# EAGLE design SAS_rev03 (EAGLE 6.6.0)
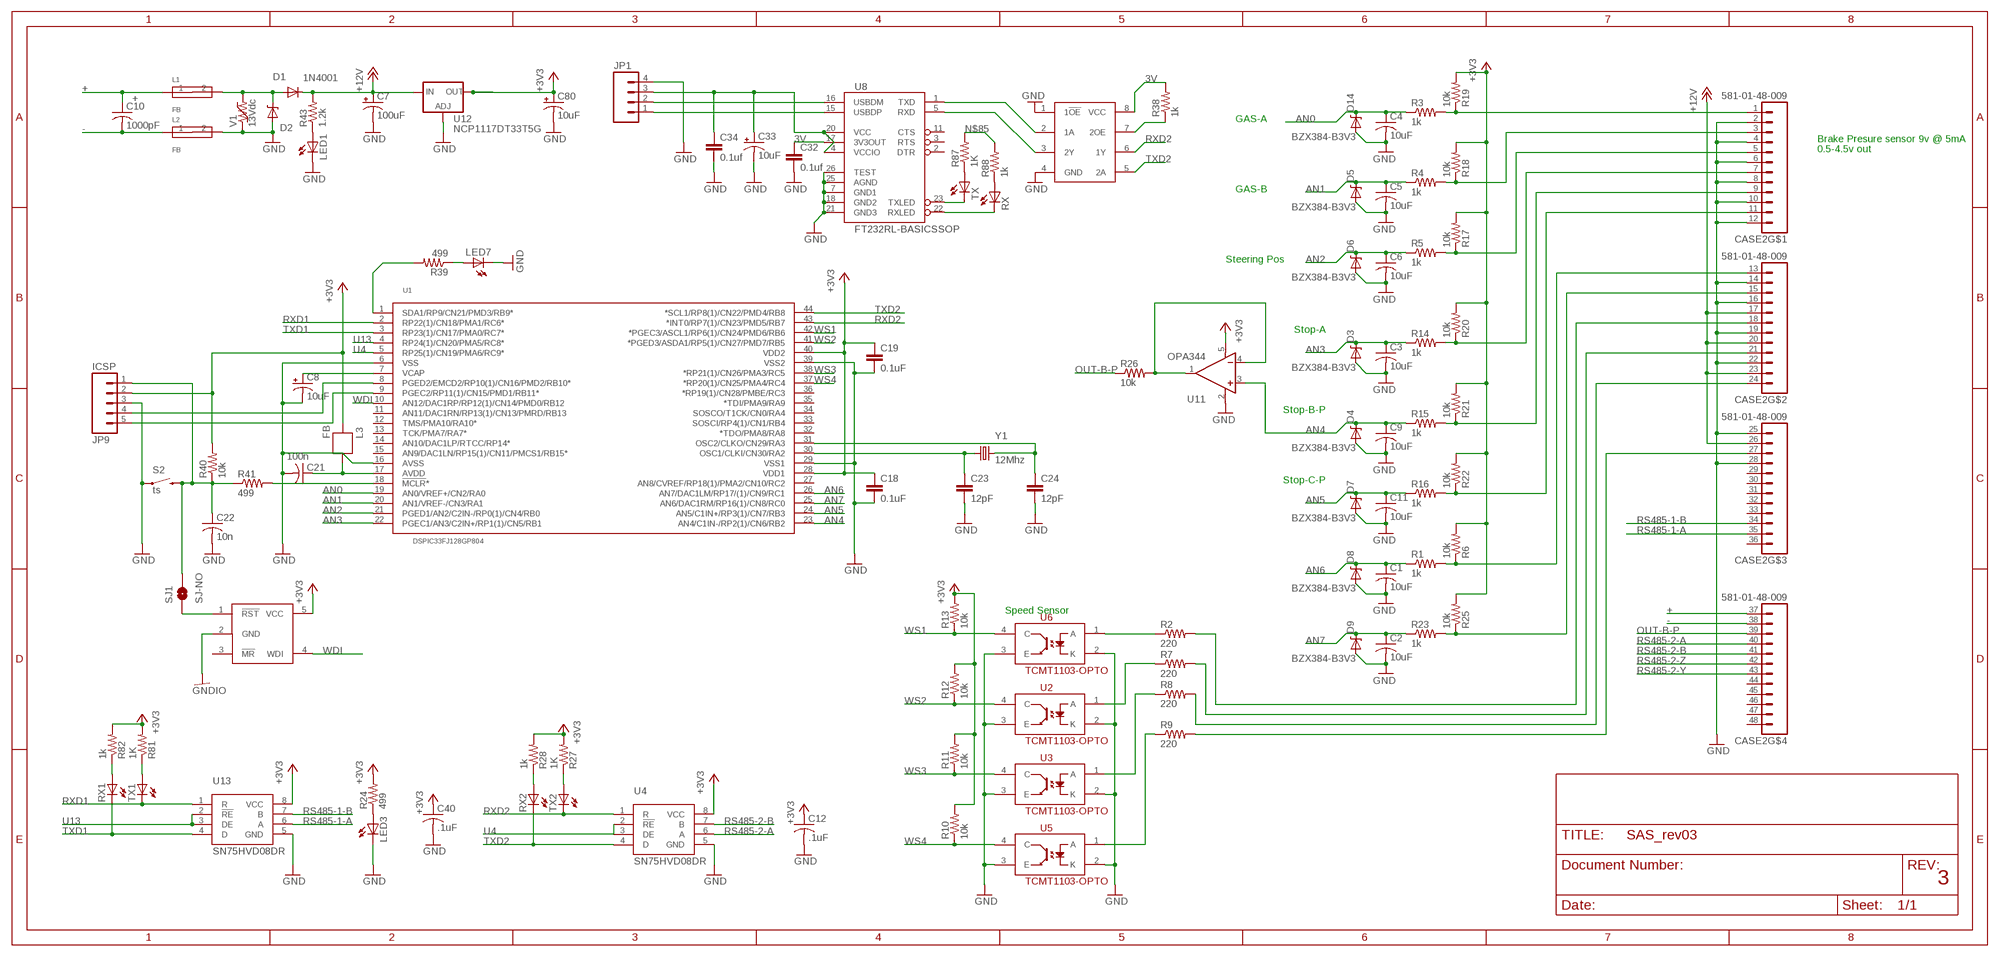
[diagram p0: schematic, sheet 1]

## Parts
C1  10uF  C-USC0805  [C0805]
C2  10uF  C-USC0805  [C0805]
C3  10uF  C-USC0805  [C0805]
C4  10uF  C-USC0805  [C0805]
C5  10uF  C-USC0805  [C0805]
C6  10uF  C-USC0805  [C0805]
C7  100uF  CAP_POL7343  [EIA7343]
C8  10uF  10UF-TANT  [EIA3216]
C9  10uF  C-USC0805  [C0805]
C10  1000pF  C-USC1825  [C1825]
C11  10uF  C-USC0805  [C0805]
C12  .1uF  C-USC0805  [C0805]
C18  0.1uF  CAP0805  [0805]
C19  0.1uF  CAP0805  [0805]
C21  100n  C-USC0805  [C0805]
C22  10n  C-USC0805  [C0805]
C23  12pF  CAP0805  [0805]
C24  12pF  CAP0805  [0805]
C32  0.1uf  CAP0805  [0805]
C33  10uF  CAP_POL1206  [EIA3216]
C34  0.1uf  CAP0805  [0805]
C40  .1uF  C-USC0805  [C0805]
C80  10uF  POLCAP  [POLC1206]
CASE2  581-01-48-009  [581-01-48-009]
D1  1N4001  DIODE-SOD123  [SOD123]
D2  MM5Z30  [SOD-523F]
D3  BZX384-B3V3  DIODE-ZENER-BZT52  [SOD-323]
D4  BZX384-B3V3  DIODE-ZENER-BZT52  [SOD-323]
D5  BZX384-B3V3  DIODE-ZENER-BZT52  [SOD-323]
D6  BZX384-B3V3  DIODE-ZENER-BZT52  [SOD-323]
D7  BZX384-B3V3  DIODE-ZENER-BZT52  [SOD-323]
D8  BZX384-B3V3  DIODE-ZENER-BZT52  [SOD-323]
D9  BZX384-B3V3  DIODE-ZENER-BZT52  [SOD-323]
D14  BZX384-B3V3  DIODE-ZENER-BZT52  [SOD-323]
JP1  M04POLAR  [MOLEX-1X4]
JP9  ICSP  M05LOCK_LONGPADS  [1X05_LOCK_LONGPADS]
L1  FB  FERITEBEAD  [0603]
L2  FB  FERITEBEAD  [0603]
L3  FB  [0603]
LED1  LEDCHIP-LED0805  [CHIP-LED0805]
LED3  LEDCHIP-LED0805  [CHIP-LED0805]
LED7  LEDCHIP-LED0805  [CHIP-LED0805]
R1  1k  R-US_R0805  [R0805]
R2  220  R-US_R0805  [R0805]
R3  1k  R-US_R0805  [R0805]
R4  1k  R-US_R0805  [R0805]
R5  1k  R-US_R0805  [R0805]
R6  10k  R-US_R0805  [R0805]
R7  220  R-US_R0805  [R0805]
R8  220  R-US_R0805  [R0805]
R9  220  R-US_R0805  [R0805]
R10  10k  R-US_R0805  [R0805]
R11  10k  R-US_R0805  [R0805]
R12  10k  R-US_R0805  [R0805]
R13  10k  R-US_R0805  [R0805]
R14  1k  R-US_R0805  [R0805]
R15  1k  R-US_R0805  [R0805]
R16  1k  R-US_R0805  [R0805]
R17  10k  R-US_R0805  [R0805]
R18  10k  R-US_R0805  [R0805]
R19  10k  R-US_R0805  [R0805]
R20  10k  R-US_R0805  [R0805]
R21  10k  R-US_R0805  [R0805]
R22  10k  R-US_R0805  [R0805]
R23  1k  R-US_R0805  [R0805]
R24  499  R-US_R0805  [R0805]
R25  10k  R-US_R0805  [R0805]
R26  10k  R-US_R0805  [R0805]
R27  1K  R-US_R0805  [R0805]
R28  1k  R-US_R0805  [R0805]
R38  1k  R-US_R0805  [R0805]
R39  499  RESISTOR0805-RES  [0805]
R40  10k  RESISTOR0805-RES  [0805]
R41  499  RESISTOR0805-RES  [0805]
R43  1.2k  R-US_R0805  [R0805]
R81  1K  R-US_R0805  [R0805]
R82  1k  R-US_R0805  [R0805]
R87  1K  R-US_R0805  [R0805]
R88  1k  R-US_R0805  [R0805]
RX  LEDCHIPLED_0805  [CHIPLED_0805]
RX1  LEDCHIPLED_0805  [CHIPLED_0805]
RX2  LEDCHIPLED_0805  [CHIPLED_0805]
S2  ts  SWITCH-MOMENTARY-2PTH  [TACTILE-PTH]
SJ1  SJ-NO  SOLDERJUMPERNO  [SJ_2S-NO]
TX  LEDCHIPLED_0805  [CHIPLED_0805]
TX1  LEDCHIPLED_0805  [CHIPLED_0805]
TX2  LEDCHIPLED_0805  [CHIPLED_0805]
U1  DSPIC33FJ128GP804  [TQFP-44]
U2  TCMT1103-OPTO  [SSOP-4]
U3  TCMT1103-OPTO  [SSOP-4]
U4  SN75HVD08DR  [SO-8]
U5  TCMT1103-OPTO  [SSOP-4]
U6  TCMT1103-OPTO  [SSOP-4]
U8  FT232RL-BASICSSOP  [SSOP28DB]
U9  MAX823  [SOT23-5L]
U11  OPA344  [SOT23-5]
U12  NCP1117DT33T5G  V_REG_317DPACK  [V-REG_DPACK]
U13  SN75HVD08DR  [SO-8]
U14  SN74LVC2G241DCTR  [VFSOP-8]
V1  13Vdc  VAR-RES  [0603]
Y1  12Mhz  CRYSTAL5X3  [CRYSTAL-SMD-5X3]

## Nets
3V: C32.1 R38.2 U8.17(3V3OUT) U14.8(VCC)
+: C10.1 CASE2.37 L1.1
+3V3: C12.1 C18.1 C19.1 C40.1 C80.1(+) JP9.2 L3.2 R6.2 R10.2 R11.2 R12.2 R13.2 R17.2 R18.2 R19.2 R20.2 R21.2 R22.2 R24.2 R25.2 R27.2 R28.2 R40.2 R81.2 R82.2 U1.28(VDD1) U1.40(VDD2) U4.8(VCC) U9.5(VCC) U11.5(V+) U12.4(OUT) U13.8(VCC)
+12V: C7.A(+) CASE2.17 CASE2.20 CASE2.23 CASE2.26 D1.C R43.2 U12.3(IN)
-: C10.2 CASE2.38 L2.1
AN0: C4.1 D14.1(C) R3.1 U1.19(AN0/VREF+/CN2/RA0)
AN1: C5.1 D5.1(C) R4.1 U1.20(AN1/VREF-/CN3/RA1)
AN2: C6.1 D6.1(C) R5.1 U1.21(PGED1/AN2/C2IN-/RP0(1)/CN4/RB0)
AN3: C3.1 D3.1(C) R14.1 U1.22(PGEC1/AN3/C2IN+/RP1(1)/CN5/RB1)
AN4: C9.1 D4.1(C) R15.1 U1.23(AN4/C1IN-/RP2(1)/CN6/RB2) U11.3(+IN)
AN5: C11.1 D7.1(C) R16.1 U1.24(AN5/C1IN+/RP3(1)/CN7/RB3)
AN6: C1.1 D8.1(C) R1.1 U1.26(AN7/DAC1LM/RP17/(1)/CN9/RC1)
AN7: C2.1 D9.1(C) R23.1 U1.25(AN6/DAC1RM/RP16(1)/CN8/RC0)
GHT: D1.A D2.C L1.2 V1.2
GND: C1.2 C2.2 C3.2 C4.2 C5.2 C6.2 C7.C(-) C8.C(-) C9.2 C11.2 C12.2 C18.2 C19.2 C21.2 C22.2 C23.2 C24.2 C32.2 C33.C(-) C34.2 C40.2 C80.2(-) CASE2.2 CASE2.4 CASE2.6 CASE2.8 CASE2.10 CASE2.12 CASE2.14 CASE2.16 CASE2.19 CASE2.22 CASE2.25 CASE2.28 D2.A D3.2(A) D4.2(A) D5.2(A) D6.2(A) D7.2(A) D8.2(A) D9.2(A) D14.2(A) JP1.4 JP9.3 L2.2 LED1.C LED3.C LED7.C S2.1 U1.6(VSS) U1.16(AVSS) U1.29(VSS1) U1.39(VSS2) U2.2(K) U2.3(E) U3.2(K) U3.3(E) U4.5(GND) U5.2(K) U5.3(E) U6.2(K) U6.3(E) U8.7(GND1) U8.18(GND2) U8.21(GND3) U8.25(AGND) U8.26(TEST) U11.2(V-) U12.1(ADJ) U13.5(GND) U14.1(1!OE) U14.4(GND) V1.1
GNDIO: U9.2(GND)
N$1: C22.1 JP9.1 R40.1 R41.1 S2.3 SJ1.2
N$2: C21.1 L3.1 U1.17(AVDD)
N$3: CASE2.13 R1.2 R6.1
N$4: C8.A(+) U1.7(VCAP)
N$5: R39.2 U1.1(SDA1/RP9/CN21/PMD3/RB9*)
N$6: LED1.A R43.1
N$7: CASE2.1 R3.2 R19.1
N$8: R41.2 U1.18(!MCLR!*)
N$9: CASE2.15 R23.2 R25.1
N$10: SJ1.1 U9.1(!RST)
N$11: CASE2.18 R2.2
N$12: JP9.4 U1.8(PGED2/EMCD2/RP10(1)/CN16/PMD2/RB10*)
N$13: CASE2.3 R4.2 R18.1
N$14: CASE2.5 R5.2 R17.1
N$15: JP9.5 U1.9(PGEC2/RP11(1)/CN15/PMD1/RB11*)
N$16: CASE2.21 R7.2
N$17: CASE2.24 R8.2
N$18: CASE2.27 R9.2
N$19: R2.1 U6.1(A)
N$20: R7.1 U2.1(A)
N$21: R8.1 U3.1(A)
N$22: R9.1 U5.1(A)
N$23: R26.2 U11.1(OUT) U11.4(-IN)
N$25: LED3.A R24.1
N$26: CASE2.7 R14.2 R20.1
N$27: CASE2.9 R15.2 R21.1
N$28: CASE2.11 R16.2 R22.1
N$31: R27.1 TX2.A
N$32: R28.1 RX2.A
N$36: R38.1 U14.7(2OE)
N$37: LED7.A R39.1
N$39: C24.1 U1.31(OSC2/CLKO/CN29/RA3) Y1.3
N$40: C23.1 U1.30(OSC1/CLKI/CN30/RA2) Y1.1
N$78: JP1.2 U8.16(USBDM)
N$79: JP1.1 U8.15(USBDP)
N$81: R87.1 TX.A
N$82: R88.1 RX.A
N$83: TX.C U8.23(TXLED)
N$84: RX.C U8.22(RXLED)
N$85: C33.A(+) C34.1 JP1.3 R87.2 R88.2 U8.4(VCCIO) U8.20(VCC)
N$86: R81.1 TX1.A
N$87: R82.1 RX1.A
N$93: U8.1(TXD) U14.2(1A)
N$94: U8.5(RXD) U14.3(2Y)
OUT-B-P: CASE2.39 R26.1
RS485-1-A: CASE2.35 U13.6(A)
RS485-1-B: CASE2.34 U13.7(B)
RS485-2-A: CASE2.40 U4.6(A)
RS485-2-B: CASE2.41 U4.7(B)
RS485-2-Y: CASE2.43
RS485-2-Z: CASE2.42
RXD1: TX1.C U1.2(RP22(1)/CN18/PMA1/RC6*) U13.1(R)
RXD2: TX2.C U1.43(*INT0/RP7(1)/CN23/PMD5/RB7) U4.1(R) U14.6(1Y)
TXD1: RX1.C U1.3(RP23(1)/CN17/PMA0/RC7*) U13.4(D)
TXD2: RX2.C U1.44(*SCL1/RP8(1)/CN22/PMD4/RB8) U4.4(D) U14.5(2A)
U4: U1.5(RP25(1)/CN19/PMA6/RC9*) U4.2(!RE) U4.3(DE)
U13: U1.4(RP24(1)/CN20/PMA5/RC8*) U13.2(!RE) U13.3(DE)
WDI: U1.10(AN12/DAC1RP/RP12(1)/CN14/PMD0/RB12) U9.4(WDI)
WS1: R13.1 U1.42(*PGEC3/ASCL1/RP6(1)/CN24/PMD6/RB6) U6.4(C)
WS2: R12.1 U1.41(*PGED3/ASDA1/RP5(1)/CN27/PMD7/RB5) U2.4(C)
WS3: R11.1 U1.38(*RP21(1)/CN26/PMA3/RC5) U3.4(C)
WS4: R10.1 U1.37(*RP20(1)/CN25/PMA4/RC4) U5.4(C)
Unconnected: CASE2.29 CASE2.30 CASE2.31 CASE2.32 CASE2.33 CASE2.36 CASE2.44 CASE2.45 CASE2.46 CASE2.47 CASE2.48 U1.11(AN11/DAC1RN/RP13(1)/CN13/PMRD/RB13) U1.12(TMS/PMA10/RA10*) U1.13(TCK/PMA7/RA7*) U1.14(AN10/DAC1LP/RTCC/RP14*) U1.15(AN9/DAC1LN/RP15(1)/CN11/PMCS1/RB15*) U1.27(AN8/CVREF/RP18(1)/PMA2/CN10/RC2) U1.32(*TDO/PMA8/RA8) U1.33(SOSCI/RP4(1)/CN1/RB4) U1.34(SOSCO/T1CK/CN0/RA4) U1.35(*TDI/PMA9/RA9) U1.36(*RP19(1)/CN28/PMBE/RC3) U8.2(DTR) U8.3(RTS) U8.11(CTS) U9.3(!MR)

## Notes on the sheet
- GAS-A
- Brake Presure sensor 9v @ 5mA
- 0.5-4.5v out
- GAS-B
- Steering Pos
- Stop-A
- Stop-B-P
- Stop-C-P
- Speed Sensor
- 3

## Library data of the parts
C1-C6 C9-C12 C21 C22 C40 = adafruit:C-US: CAPACITOR, American symbol
C7 = SparkFun-Capacitors:CAP_POL: Capacitor Polarized These are standard SMD and PTH capacitors. Normally 10uF, 47uF, and 100uF in electrolytic and tantalum varieties. Always verify the external diameter of the through hole cap, it varies with capacity, voltage, and manufacturer. The EIA devices should be standard.
C8 = SparkFun-Capacitors:10UF-TANT: 10uF Tantalum SMT CAP-00811- 16V 10% (EIA-3216); PROD_ID: CAP-00811
C18 C19 C23 C24 = SparkFun-Capacitors:CAP: Capacitor Standard 0603 ceramic capacitor, and 0.1" leaded capacitor.
C32 C34 = SparkFun:CAP: Capacitor Standard 0603 ceramic capacitor, and 0.1" leaded capacitor.
C33 = SparkFun:CAP_POL: Capacitor Polarized These are standard SMD and PTH capacitors. Normally 10uF, 47uF, and 100uF in electrolytic and tantalum varieties. Always verify the external diameter of the through hole cap, it varies with capacity, voltage, and manufacturer. The EIA devices should be standard.
C80 = RJ's_parts:POLCAP
CASE2 = FSAE Eletric:581-01-48-009
D1 = diode:DIODE-: DIODE
D2 = EmEndev:MM5Z30
D3-D9 D14 = SparkFun:DIODE-ZENER: Zener Diode Production Part - 8199 3.4V Zener Voltage
JP1 = SparkFun-Connectors:M04: Header 4 Standard 4-pin 0.1" header. Use with straight break away headers (SKU : PRT-00116), right angle break away headers (PRT-00553), swiss pins (PRT-00743), machine pins (PRT-00117), and female headers (PRT-00115). Molex polarized connector foot print use with SKU : PRT-08231 with associated crimp pins and housings. 1MM SMD Version SKU: PRT-10208
JP9 = SparkFun-Connectors:M05: Header 5 Standard 5-pin 0.1" header. Use with straight break away headers (SKU : PRT-00116), right angle break away headers (PRT-00553), swiss pins (PRT-00743), machine pins (PRT-00117), and female headers (PRT-00115). Molex polarized connector foot print use with SKU : PRT-08230 with associated crimp pins and housings.
L1 L2 = EmEndev:FERITEBEAD
L3 = SparkFun-Passives:FB
LED1 LED3 LED7 RX RX1 RX2 TX TX1 TX2 = adafruit:LED: LED OSRAM: - CHIPLED LG R971, LG N971, LY N971, LG Q971, LY Q971, LO R971, LY R971 LH N974, LH R974 LS Q976, LO Q976, LY Q976 LO Q996 - Hyper CHIPLED LW Q18S LB Q993, LB Q99A, LB R99A - SideLED LS A670, LO A670, LY A670, LG A670, LP A670 LB A673, LV A673, LT A673, LW A673 LH A674 LY A675 LS A676, LA A676, LO A676, LY A676, LW A676 LS A679, LY A679, LG A679 - Hyper Micro SIDELED® LS Y876, LA Y876, LO Y876, LY Y876 LT Y87S - SmartLED LW L88C, LW L88S LB L89C, LB L89S, LG L890 LS L89K, LO L89K, LY L89K LS L896, LA L896, LO L896, LY L896 - TOPLED LS T670, LO T670, LY T670, LG T670, LP T670 LSG T670, LSP T670, LSY T670, LOP T670, LYG T670 LG T671, LOG T671, LSG T671 LB T673, LV T673, LT T673, LW T673 LH T674 LS T676, LA T676, LO T676, LY T676, LB T676, LH T676, LSB T676, LW T676 LB T67C, LV T67C, LT T67C, LS T67K, LO T67K, LY T67K, LW E67C LS E67B, LA E67B, LO E67B, LY E67B, LB E67C, LV E67C, LT E67C LW T67C LS T679, LY T679, LG T679 LS T770, LO T770, LY T770, LG T770, LP T770 LB T773, LV T773, LT T773, LW T773 LH T774 LS E675, LA E675, LY E675, LS T675 LS T776, LA T776, LO T776, LY T776, LB T776 LHGB T686 LT T68C, LB T68C - Hyper Mini TOPLED® LB M676 - Mini TOPLED Santana® LG M470 LS M47K, LO M47K, LY M47K Source: http://www.osram.convergy.de/
R1-R28 R38 R43 R81 R82 R87 R88 = adafruit:R-US_: RESISTOR, American symbol
R39 R40 = SparkFun-Passives:RESISTOR: Resistor Basic schematic elements and footprints for 0603, 1206, and PTH resistors.
R41 = SparkFun-Resistors:RESISTOR: Resistor Basic schematic elements and footprints for 0603, 1206, and PTH resistors.
S2 = SparkFun-Electromechanical:SWITCH-MOMENTARY-2: Various NO switches- pushbuttons, reed, etc
SJ1 = SparkFun-Passives:SOLDERJUMPER: Solder Jumper Standard SMD solder jumper. Used to automate production. Two varients : Normally Open and Normally Closed are the same, but have different paste layers. NC will have a large amount of paste and should jumper during reflow.
U1 = FSAE Eletric:DSPIC33FJ128GP804
U2 U3 U5 U6 = SparkFun-DiscreteSemi:TCMT1103-OPTO: Optoisolator- NPN output
U4 U13 = FSAE Eletric:SN75HVD08DR
U8 = SparkFun:FT232RL-BASIC: USB UART This is the simplified version of the FT232RL unit. Only what you need, nothing you don't. Spark Fun Electronics SKU : COM-00650
U9 = NASA_LIB:MAX823
U11 = SparkFun-AnalogIC:OPA344: Single gate rail-to-rail output op-amp. Inputs extend 300mV past rails.
U12 = SparkFun-PowerIC:V_REG_317: Voltage Regulator Standard LM317 adjustable voltage regulator. AOI (Adjust Output Input). Google 'LM317 Calculator' for easy to use app to get the two resistor values needed. 240/720 for 5V output. 240/390 for 3.3V output. Spark Fun Electronics SKU : COM-00527
U14 = Cleaverbrooks:SN74LVC2G241DCTR
V1 = EmEndev:VAR-RES
Y1 = SparkFun-FreqCtrl:CRYSTAL: Various standard crystals. Proven footprints. Spark Fun Electronics SKU : COM-00534

## Board
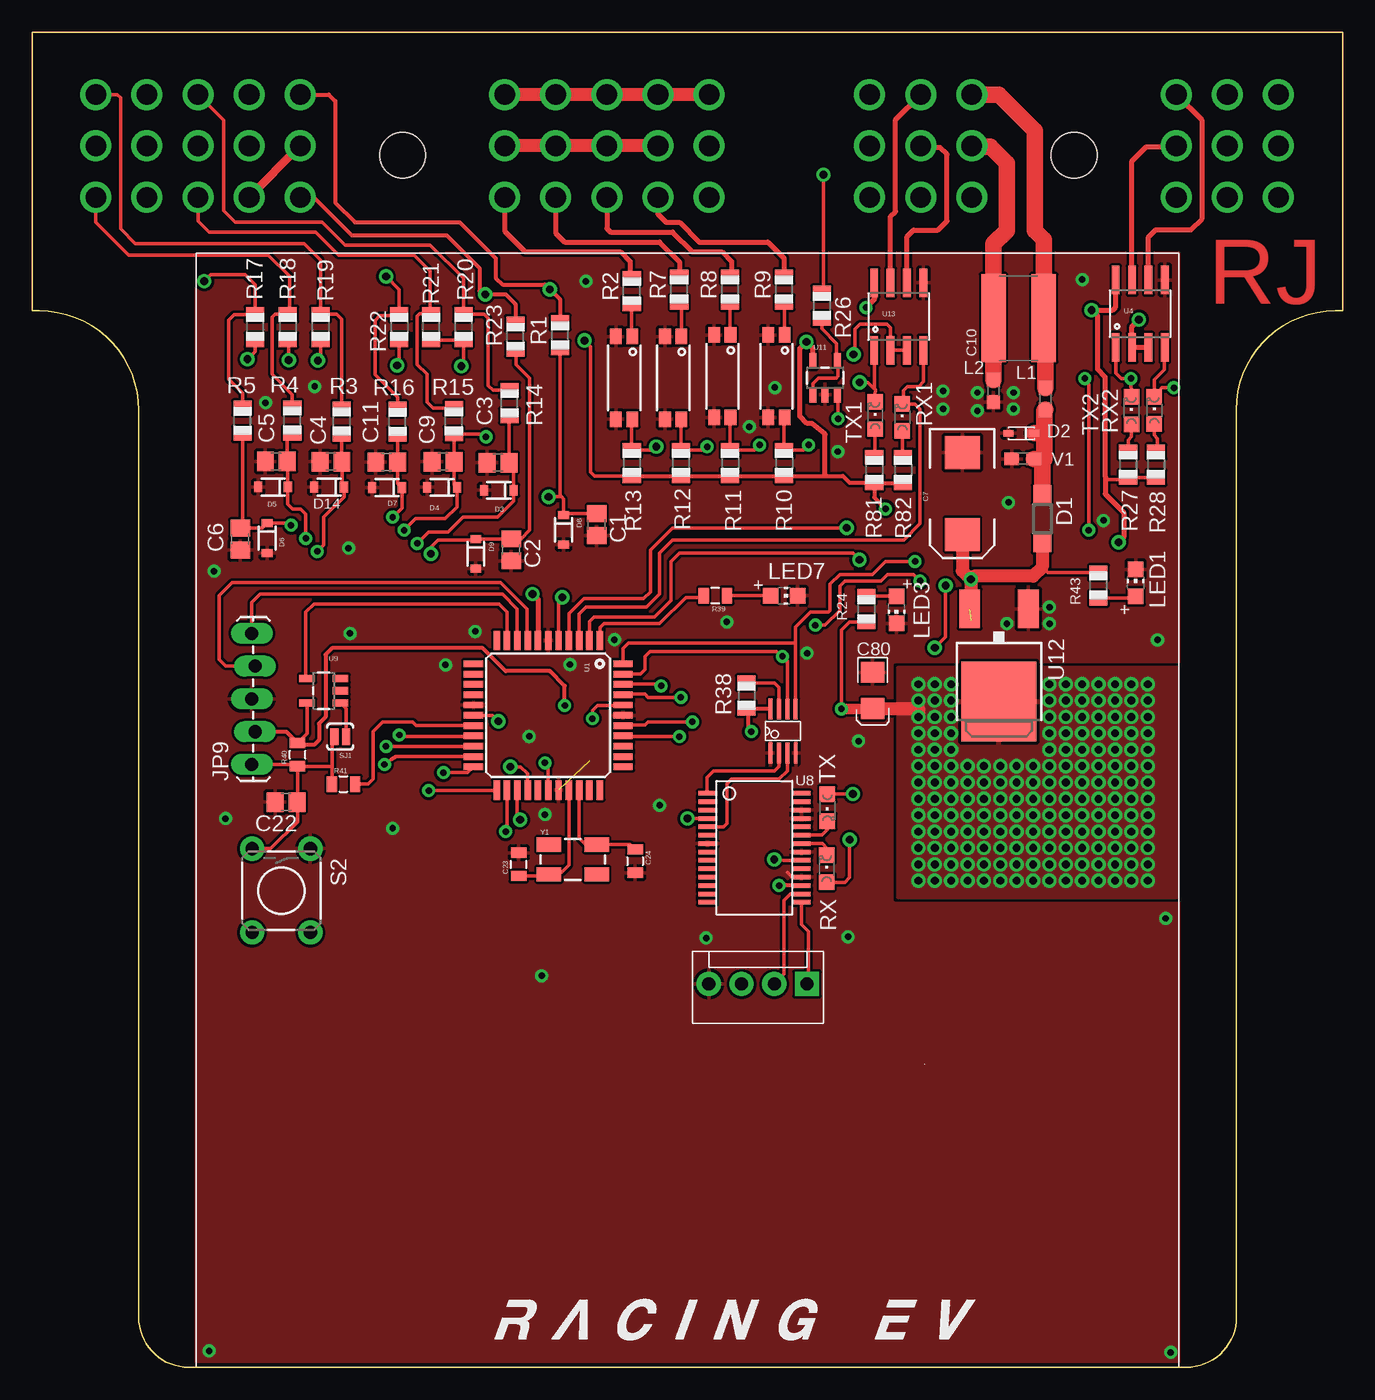
[diagram p1: board, top side]
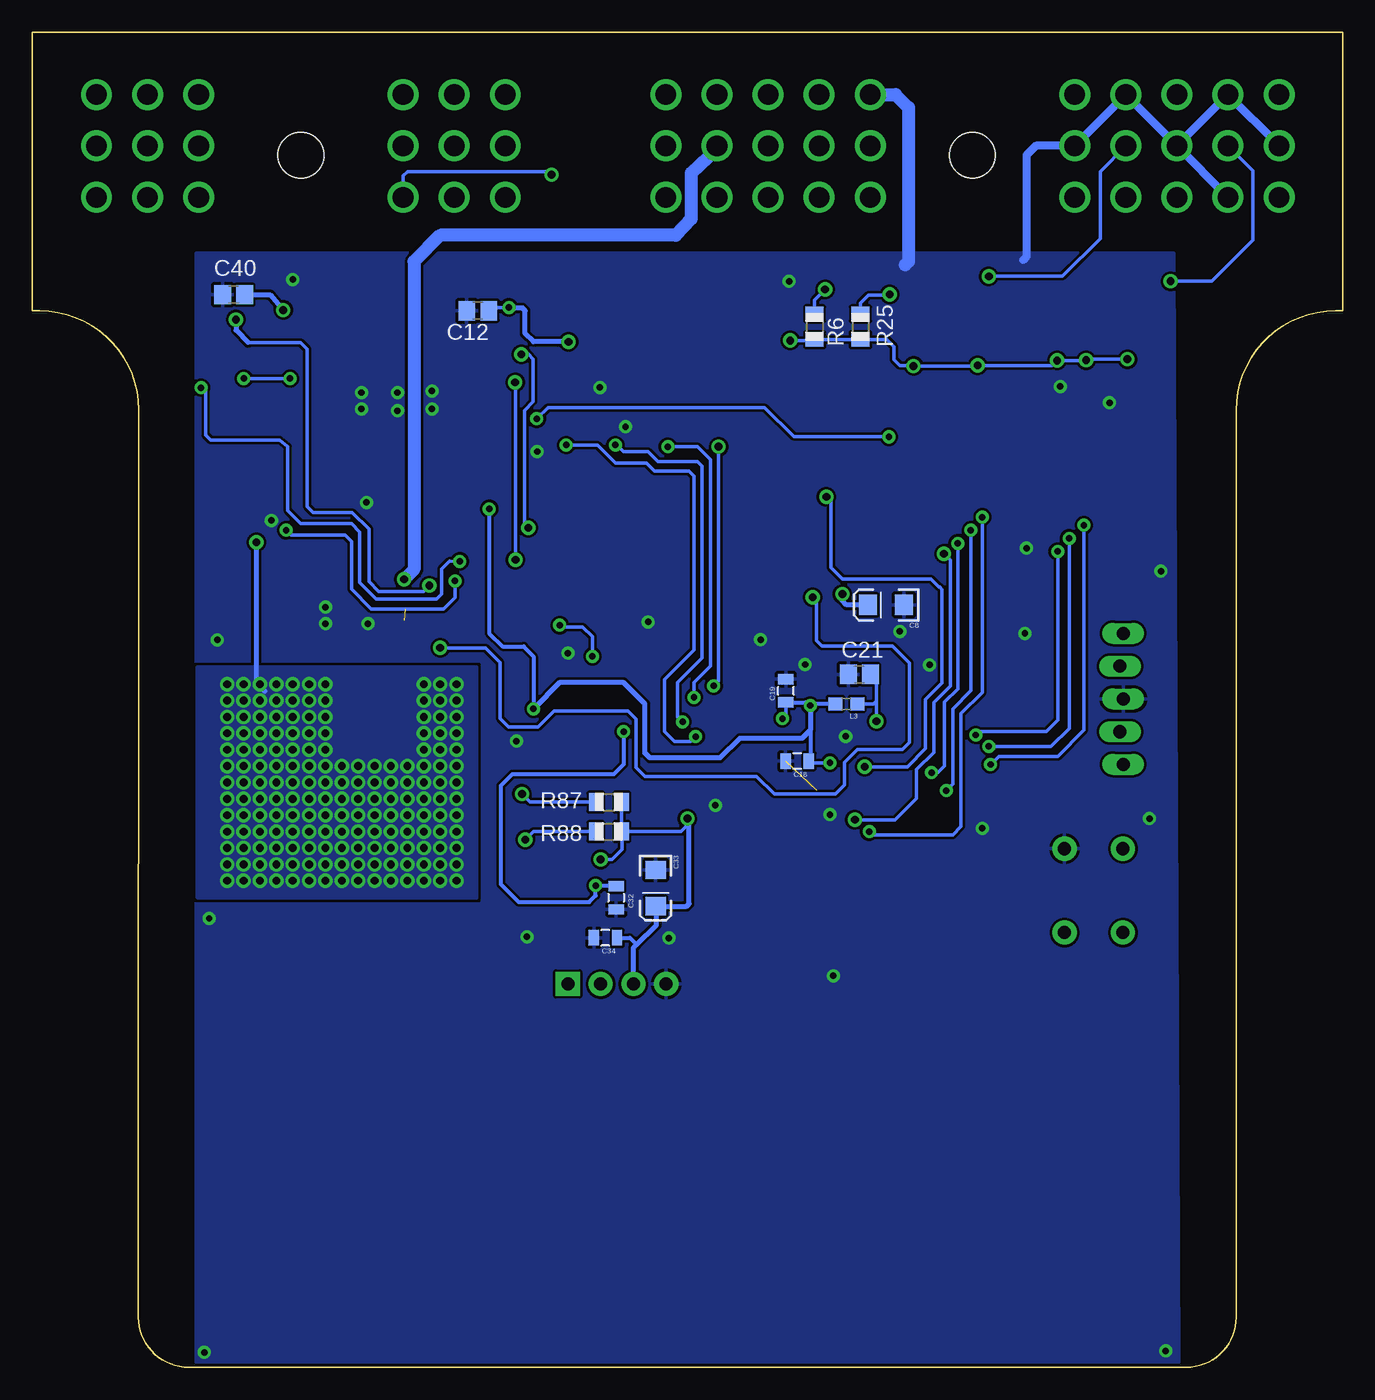
[diagram p2: board, bottom side, seen from below]

Size 101.6 x 103.51 mm. Coordinates in mm from the lower left corner, seen from the top.
Copper layers (1*16): Top 0.035mm / dielectric 1.5mm / Bottom 0.035mm
Design rules "SparkFun": minimum track width 8mil, minimum drill 20mil, track to track 8mil, track to pad 8mil, pad to pad 8mil, via to via 8mil, smd to smd 8mil, copper to edge 10mil, drill to drill 8mil, minimum pad ring 12mil, minimum via ring 10mil, stop-mask expansion 4mil, vias tented up to drill 25mil, thermal gap 10mil

### Footprints (pad centres in the part's own frame; a part is rotated, then mirrored left to right if it is on the bottom)
C0805 = smd 1.3 x 1.5: 1 -0.85,0; 2 0.85,0
EIA7343 = smd 2.55 x 2.7: A 3.17,0; C -3.17,0
EIA3216 = smd 1.4 x 1.6: A 1.4,0; C -1.4,0
C1825 = smd 1.9 x 6.8: 1 -1.95,0; 2 1.95,0
0805 = smd 0.8 x 1.2: 1 -0.9,0; 2 0.9,0
POLC1206 = smd 1.6 x 1.8: 1 -1.4,0; 2 1.4,0
581-01-48-009 = drill 1.6: 1 -45.872,4.699; 2 -45.872,0.711; 3 -45.872,-3.277; 4 -41.91,4.699; 5 -41.91,0.711; 6 -41.91,-3.277; 7 -37.948,4.699; 8 -37.948,0.711; 9 -37.948,-3.277; 10 -33.985,4.699; 11 -33.985,0.711; 12 -33.985,-3.277; 13 -30.023,4.699; 14 -30.023,0.711; 15 -30.023,-3.277; 16 -14.173,4.699; 17 -14.173,0.711; 18 -14.173,-3.277; 19 -10.211,4.699; 20 -10.211,0.711; 21 -10.211,-3.277; 22 -6.248,4.699; 23 -6.248,0.711; 24 -6.248,-3.277; 25 -2.286,4.699; 26 -2.286,0.711; 27 -2.286,-3.277; 28 1.676,4.699; 29 1.676,0.711; 30 1.676,-3.277; 31 14.122,4.699; 32 14.122,0.711; 33 14.122,-3.277; 34 18.085,4.699; 35 18.085,0.711; 36 18.085,-3.277; 37 22.047,4.699; 38 22.047,0.711; 39 22.047,-3.277; 40 37.897,4.699; 41 37.897,0.711; 42 37.897,-3.277; 43 41.859,4.699; 44 41.859,0.711; 45 41.859,-3.277; 46 45.822,4.699; 47 45.822,0.711; 48 45.822,-3.277 | hole 3.556: -22.098,0; 29.972,0
SOD123 = smd 1.4 x 1.4: A 1.9,0; C -1.9,0
SOD-523F = smd 0.8 x 0.5: A -1,0; C 1,0
SOD-323 = smd 0.63 x 0.83: 1 -1.15,0; 2 1.15,0
MOLEX-1X4 = drill 1.016 pad 1.88 square: 1 0,0 | drill 1.016 pad 1.88: 2 2.54,0; 3 5.08,0; 4 7.62,0
1X05_LOCK_LONGPADS = drill 1.016 long: 1 0,0; 2 2.54,-0.254; 3 5.08,0; 4 7.62,-0.254; 5 10.16,0
0603 = smd 1.1 x 1: 1 -0.85,0; 2 0.85,0
CHIP-LED0805 = smd 1.2 x 1.2: A 0,-1.05; C 0,1.05
R0805 = smd 1.1 x 1.4: 1 -1,0; 2 1,0
CHIPLED_0805 = smd 1.2 x 1.2: A 0,-1.05; C 0,1.05
TACTILE-PTH = drill 1.016 pad 1.88: 1 -3.251,2.261; 2 3.251,2.261; 3 -3.251,-2.261; 4 3.251,-2.261
SJ_2S-NO = smd 0.635 x 1.27: 1 -0.45,0; 2 0.45,0
TQFP-44 = smd 1.5 x 0.5: 1 -5.8,4; 2 -5.8,3.2; 3 -5.8,2.4; 4 -5.8,1.6; 5 -5.8,0.8; 6 -5.8,0; 7 -5.8,-0.8; 8 -5.8,-1.6; 9 -5.8,-2.4; 10 -5.8,-3.2; 11 -5.8,-4; 23 5.8,-4; 24 5.8,-3.2; 25 5.8,-2.4; 26 5.8,-1.6; 27 5.8,-0.8; 28 5.8,0; 29 5.8,0.8; 30 5.8,1.6; 31 5.8,2.4; 32 5.8,3.2; 33 5.8,4 | smd 0.5 x 1.5: 12 -4,-5.8; 13 -3.2,-5.8; 14 -2.4,-5.8; 15 -1.6,-5.8; 16 -0.8,-5.8; 17 0,-5.8; 18 0.8,-5.8; 19 1.6,-5.8; 20 2.4,-5.8; 21 3.2,-5.8; 22 4,-5.8; 34 4,5.8; 35 3.2,5.8; 36 2.4,5.8; 37 1.6,5.8; 38 0.8,5.8; 39 0,5.8; 40 -0.8,5.8; 41 -1.6,5.8; 42 -2.4,5.8; 43 -3.2,5.8; 44 -4,5.8
SSOP-4 = smd 1.2 x 0.9: 1 -3.2,0.67; 2 -3.2,-0.6; 3 3.2,-0.6; 4 3.2,0.67
SO-8 = smd 0.61 x 2.21: 1 -1.905,-2.616; 2 -0.635,-2.616; 3 0.635,-2.616; 4 1.905,-2.616; 5 1.905,2.616; 6 0.635,2.616; 7 -0.635,2.616; 8 -1.905,2.616
SSOP28DB = smd 0.348 x 1.397: 1 -4.225,-3.656; 2 -3.575,-3.656; 3 -2.925,-3.656; 4 -2.275,-3.656; 5 -1.625,-3.656; 6 -0.975,-3.656; 7 -0.325,-3.656; 8 0.325,-3.656; 9 0.975,-3.656; 10 1.625,-3.656; 11 2.275,-3.656; 12 2.925,-3.656; 13 3.575,-3.656; 14 4.225,-3.656; 15 4.225,3.656; 16 3.575,3.656; 17 2.925,3.656; 18 2.275,3.656; 19 1.625,3.656; 20 0.975,3.656; 21 0.325,3.656; 22 -0.325,3.656; 23 -0.975,3.656; 24 -1.625,3.656; 25 -2.275,3.656; 26 -2.925,3.656; 27 -3.575,3.656; 28 -4.225,3.656
SOT23-5L = smd 0.55 x 1.2: 1 -0.95,-1.3; 2 0,-1.3; 3 0.95,-1.3; 4 0.95,1.3; 5 -0.95,1.3
SOT23-5 = smd 0.55 x 1.2: 1 -0.95,-1.3; 2 0,-1.3; 3 0.95,-1.3; 4 0.95,1.3; 5 -0.95,1.3
V-REG_DPACK = smd 1.6 x 3: 1 -2.28,-4.8; 3 2.28,-4.8 | smd 5.8 x 6.2: 4 0,2.38
VFSOP-8 = smd 0.3 x 1.6: 1 -0.98,-1.7; 2 -0.33,-1.7; 3 0.33,-1.7; 4 0.98,-1.7; 5 0.97,1.69; 6 0.325,1.7; 7 -0.33,1.7; 8 -0.98,1.71
CRYSTAL-SMD-5X3 = smd 1.9 x 1.1: 1 -1.85,-1.15; 2 1.85,-1.15; 3 1.85,1.15; 4 -1.85,1.15

### Placement (x,y rotation side)
C1  43.76,65.33 270 top
C2  37.13,63.37 270 top
C3  36.12,70.13 180 top
C4  23.16,70.21 180 top
C5  18.92,70.23 180 top
C6  16.13,64.21 270 top
C7  72.11,67.74 270 top
C8  35.41,59.11 180 bottom
C9  31.85,70.21 180 top
C10  76.47,81.34 180 top
C11  27.48,70.18 180 top
C12  67.06,81.92 180 bottom
C18  42.29,46.99 180 bottom
C19  43.18,52.45 90 bottom
C21  37.47,53.72 180 bottom
C22  19.69,43.82 180 top
C23  37.72,38.99 90 top
C24  46.74,39.24 270 top
C32  56.34,36.4 270 bottom
C33  53.26,37.15 270 bottom
C34  57.16,33.3 180 bottom
C40  85.98,83.16 180 bottom
C80  65.16,52.47 90 top
CASE2  50.8,93.98 0 top
D1  78.31,65.79 90 top
D2  76.68,72.41 0 top
D3  36.17,68 180 top
D4  31.78,68.22 180 top
D5  18.67,68.25 180 top
D6  18.21,64.29 270 top
D7  27.51,68.2 180 top
D8  41.2,64.92 270 top
D9  34.39,63.07 270 top
D14  23.01,68.24 180 top
JP1  60.07,29.72 180 top
JP9  17.02,46.74 90 top
L1  78.53,75.08 270 top
L2  74.51,75.69 270 top
L3  38.48,51.44 180 bottom
LED1  85.55,60.81 0 top
LED3  67.01,58.72 180 top
LED7  58.29,59.82 270 top
R1  40.92,80.01 90 top
R2  46.48,83.44 90 top
R3  24,73.33 90 top
R4  20.17,73.41 90 top
R5  16.31,73.38 90 top
R6  40.94,80.67 270 bottom
R7  50.17,83.57 90 top
R8  54.1,83.57 90 top
R9  58.29,83.57 90 top
R10  58.29,70.1 270 top
R11  54.1,70.1 270 top
R12  50.29,70.1 270 top
R13  46.48,70.1 270 top
R14  37.01,74.75 90 top
R15  32.69,73.36 90 top
R16  28.32,73.3 90 top
R17  17.27,80.65 270 top
R18  19.81,80.65 270 top
R19  22.35,80.65 270 top
R20  33.43,80.65 270 top
R21  30.91,80.65 270 top
R22  28.45,80.65 270 top
R23  37.47,79.91 90 top
R24  64.67,58.78 270 top
R25  37.39,80.67 270 bottom
R26  61.21,82.3 270 top
R27  84.96,69.98 270 top
R28  87.12,69.98 270 top
R38  55.37,52.07 270 top
R39  52.96,59.82 180 top
R40  20.57,47.5 90 top
R41  24.13,45.21 0 top
R43  82.67,60.62 90 top
R81  65.28,69.57 270 top
R82  67.51,69.57 270 top
R87  56.9,43.82 0 bottom
R88  56.9,41.53 0 bottom
RX  61.6,38.66 0 top
RX1  67.46,73.66 0 top
RX2  87,74.19 0 top
S2  19.3,36.96 270 top
SJ1  23.88,48.9 180 top
TX  61.65,43.38 180 top
TX1  65.35,73.79 0 top
TX2  85.22,74.17 0 top
U1  40.01,50.55 270 top
U2  49.66,76.71 270 top
U3  53.47,76.84 270 top
U4  85.9,81.69 0 top
U5  57.66,76.84 270 top
U6  45.85,76.71 270 top
U8  55.99,40.27 270 top
U9  22.61,52.45 90 top
U11  61.47,76.71 0 top
U12  74.96,54 180 top
U13  67.18,81.46 0 top
U14  58.22,49.33 0 top
U$2  [L-L]  20.83,-1.9 0 top
V1  76.79,70.43 0 top
Y1  41.91,39.37 0 top

### Tracks (layer width: path | path; a pad name or v marks a point on that pad's centre or on a via)
3V  (via drill 0.5)
  Top 0.254: U14.8 55.41,51.04 R38.2
  Top 0.305: U14.8 55.61,51.04 55.5,50.93 55.5,49.53 v55.75,49.28 | U8.17 v57.92,37.35 v57.91,37.34
  Bottom 0.305: v55.75,49.28 55.75,46.74 56.52,45.97 64.39,45.97 65.28,45.09 65.28,37.47 63.88,36.07 58.42,36.07 57.91,36.58 v57.91,37.34 57.28,37.34 56.38,37.34 C32.1
+
  Top 1.27: CASE2.37 74.93,98.68 77.72,95.89 77.72,88.14 78.42,87.44 C10.1 78.53,81.23 L1.1
+3V3  (via drill 0.5, 0.6)
  Top 0.254: R28.2 R27.2 84.82,68.83 83.44,68.83 83.19,69.09 | U9.5 21.31,49.13 R40.2 | v43.43,50.29 43.43,50.93 43.82,51.31 45.77,51.31 U1.40 | U1.28 40.01,46.61 v39.75,46.86 | 64.9,81.92 v64.64,82.17 | R24.2 63.36,57.78 62.74,57.15 v62.74,51.05 | R17.2 17.27,78.74 v16.69,78.16 | v19.89,78.08 19.89,79.57 R18.2 | R19.2 22.35,78.26 v22.15,78.05 | R22.2 28.45,77.83 v28.3,77.67 | R21.2 R20.2 33.43,77.78 v33.27,77.62 | R13.2 43.6,69.1 43.28,69.42 43.28,79.15 v42.82,79.6
  Top 0.305: v41.28,51.31 41.28,52.83 40.13,53.98 36.7,53.98 34.92,55.75 23.24,55.75 22.73,55.25 22.73,50.42 22.23,49.91 22.23,48.64 21.84,48.26 20.71,48.26 R40.2 19.7,49.28 JP9.2 | R81.2 R82.2 | 61.6,69.1 R10.2 R11.2 R12.2 R13.2 | 61.6,69.1 62.85,69.1 63.37,68.58 65.27,68.58 R81.2 | R81.2 65.28,67.44 v66.17,66.55 | 61.47,69.21 61.6,69.1
  Top 0.406: v84.23,63.96 84.63,64.36 84.63,66.27 83.19,67.72 83.19,69.09 83.19,76.78 82.6,77.37 82.6,81.51 v82.14,81.97 83.77,81.97 84,82.19 U4.8 | U13.8 65.28,82.8 v64.64,82.17 | U11.5 60.52,79 v60.02,79.5 59.51,78.99 59.51,73.74 60.07,73.18 60.45,73.18 61.47,72.34 61.47,69.21
  Top 0.813: v62.74,51.05 65.14,51.05 C80.1
  Top 1.016: C80.1 68.71,51.07 v68.71,50.42
  Bottom 0.254: C19.1 43.18,50.55 v43.43,50.29 | v39.75,46.86 41.26,46.86 C18.1 | v64.64,82.17 65.95,82.17 C12.1 | L3.2 41.15,51.44 v41.28,51.31 | v16.69,78.16 19.81,78.16 v19.89,78.08 19.91,78.05 v22.15,78.05 22.53,77.67 v28.3,77.67 28.35,77.62 v33.27,77.62 33.3,77.65 34.31,77.65 34.8,78.13 34.8,79.12 35.35,79.67 R25.2 R6.2 41.01,79.6 v42.82,79.6
  Bottom 0.305: L3.2 41.02,51.44 41.28,51.18 | 41.28,51.18 41.28,47.11 C18.1 | C19.1 41.65,51.55 41.28,51.18 | v66.17,66.55 66.17,56.9 65.15,55.88 63.5,55.88 62.74,55.12 v62.74,51.05
  Bottom 0.406: 41.28,51.18 41.28,49.4 41.91,48.77 46.74,48.77 48.26,47.24 53.72,47.24 54.1,47.63 54.1,51.44 55.75,53.09 60.71,53.09 v62.74,51.05 | v84.23,63.96 84.23,53.09 83.57,52.43 | C40.1 83.16,83.16 v82.14,81.97 | v60.02,79.5 62.74,79.5 63.37,80.14 63.37,81.92 63.58,82.12 64.59,82.12 v64.64,82.17
  other vias: 68.71,52.96 68.71,51.69 68.71,49.15 68.71,47.88 68.71,46.61 69.98,46.61 69.98,47.88 69.98,49.15 69.98,50.42 69.98,51.69 69.98,52.96 71.25,52.96 71.25,51.69 71.25,50.42 71.25,49.15 71.25,47.88 71.25,46.61 71.25,45.34 69.98,45.34 68.71,45.34 68.71,44.07 69.98,44.07 71.25,44.07 72.52,44.07 72.52,45.34 72.52,46.61 77.6,46.61 77.6,45.34 73.79,46.61 75.06,46.61 76.33,46.61 76.33,45.34 75.06,45.34 73.79,45.34 73.79,44.07 75.06,44.07 76.33,44.07 77.6,44.07 78.87,46.61 80.14,46.61 81.41,46.61 81.41,45.34 80.14,45.34 78.87,45.34 78.87,44.07 80.14,44.07 81.41,44.07 78.87,47.88 68.71,42.8 69.98,42.8 71.25,42.8 71.25,41.53 69.98,41.53 68.71,41.53 68.71,40.26 69.98,40.26 71.25,40.26 72.52,40.26 72.52,41.53 72.52,42.8 77.6,42.8 77.6,41.53 73.79,42.8 75.06,42.8 76.33,42.8 76.33,41.53 75.06,41.53 73.79,41.53 73.79,40.26 75.06,40.26 76.33,40.26 77.6,40.26 78.87,42.8 80.14,42.8 81.41,42.8 81.41,41.53 80.14,41.53 78.87,41.53 78.87,40.26 80.14,40.26 81.41,40.26 82.68,40.26 82.68,41.53 82.68,42.8 82.68,44.07 82.68,45.34 82.68,46.61 82.68,47.88 82.68,49.15 82.68,50.42 82.68,51.69 82.68,52.96 83.95,40.26 83.95,41.53 83.95,42.8 85.22,42.8 85.22,41.53 85.22,40.26 86.49,40.26 86.49,41.53 86.49,42.8 86.49,44.07 85.22,44.07 83.95,44.07 83.95,49.15 85.22,49.15 83.95,45.34 83.95,46.61 83.95,47.88 85.22,47.88 85.22,46.61 85.22,45.34 86.49,45.34 86.49,46.61 86.49,47.88 86.49,49.15 83.95,50.42 83.95,51.69 83.95,52.96 85.22,52.96 85.22,51.69 85.22,50.42 86.49,50.42 86.49,51.69 86.49,52.96 78.87,49.15 78.87,50.42 78.87,51.69 78.87,52.96 80.14,52.96 80.14,51.69 80.14,50.42 80.14,49.15 80.14,47.88 81.41,47.88 81.41,49.15 81.41,50.42 81.41,51.69 81.41,52.96 68.71,38.99 69.98,38.99 71.25,38.99 72.52,38.99 73.79,38.99 75.06,38.99 76.33,38.99 77.6,38.99 78.87,38.99 80.14,38.99 81.41,38.99 82.68,38.99 83.95,38.99 85.22,38.99 86.49,38.99 68.71,37.72 69.98,37.72 71.25,37.72 72.52,37.72 73.79,37.72 75.06,37.72 76.33,37.72 77.6,37.72 78.87,37.72 80.14,37.72 81.41,37.72 82.68,37.72 83.95,37.72 85.22,37.72 86.49,37.72
  pour Bottom: 67.18,54.23 88.77,54.23 88.77,36.45 67.18,36.45
  pour Top: 67.18,54.23 88.77,54.23 88.77,36.45 67.18,36.45
+12V  (via drill 0.6)  (1 unrouted)
  Top 0.254: R43.2 78.75,61.62 78.31,62.06
  Top 1.016: CASE2.26 CASE2.23 CASE2.20 CASE2.17 | v72.77,61.09 72.77,57.88 | C7.A 72.11,61.75 v72.77,61.09 | D1.C 78.31,62.06 77.6,61.34 73.03,61.34 v72.77,61.09
  Bottom 1.016: CASE2.26 48.51,94.49 50.52,92.58 50.52,89.03 51.69,87.76 69.98,87.76 72.01,85.73 72.01,61.85 v72.77,61.09
-
  Top 1.27: CASE2.38 72.92,94.62 74.3,94.62 75.56,93.35 75.56,88.14 74.52,87.1 C10.2 74.55,81.31 74.55,80.77 74.51,80.73 L2.1
AN0  (via drill 0.5)
  Top 0.254: 34.13,49.02 U1.19 34.15,48.9 28.58,48.9 v28.45,49.02 | v22.1,63.25 22.61,63.75 22.61,65.91 24.16,67.47 D14.1 24.02,68.39 C4.1 24,70.22 R3.1
  Bottom 0.254: v22.1,63.25 22.1,50.17 22.99,49.28 28.19,49.28 v28.45,49.02
AN1  (via drill 0.5)
  Top 0.254: v21.21,64.26 21.21,66.17 20.83,66.55 20.19,66.55 19.82,66.92 D5.1 19.82,70.19 C5.1 19.77,72.01 R4.1 | v27.43,48.13 34.19,48.13 U1.20
  Bottom 0.254: v21.21,64.26 21.21,49.53 22.61,48.13 v27.43,48.13
AN2  (via drill 0.5)
  Top 0.254: v20.07,65.28 19.91,65.44 D6.1 17.84,65.06 C6.1 16.31,65.24 R5.1 | v27.31,46.74 27.81,47.12 28.19,47.37 34.18,47.37 U1.21
  Bottom 0.254: v20.07,65.28 20.07,49.4 22.1,47.37 26.67,47.37 v27.31,46.74
AN3  (via drill 0.5)
  Top 0.254: v29.84,63.88 30.73,64.77 32.26,64.77 33.4,65.91 36.07,65.91 37.32,67.17 D3.1 37.32,69.78 C3.1 36.97,73.71 R14.1 | v31.88,46.1 33.76,46.1 U1.22
  Bottom 0.254: v29.84,63.88 29.84,52.58 30.86,51.56 30.86,46.61 31.37,46.1 v31.88,46.1
AN4  (via drill 0.5)
  Top 0.254: v28.83,64.9 29.72,65.79 32,65.79 32.92,66.71 D4.1 32.7,68.45 C9.1 R15.1 34.96,72.36 v35.18,72.14 | v30.73,44.7 35.96,44.7 U1.23 | v62.48,73.53 62.48,75.34 U11.3
  Bottom 0.254: v28.83,64.9 28.83,52.45 30.23,51.05 30.23,45.21 v30.73,44.7 | v35.18,72.14 42.55,72.14 44.83,74.42 61.6,74.42 v62.48,73.53
AN5  (via drill 0.5)
  Top 0.254: v27.94,65.91 28.66,66.63 D7.1 28.33,68.52 C11.1 28.33,72.29 R16.1 | v36.7,41.53 36.83,41.66 36.83,44.72 U1.24
  Bottom 0.254: v27.94,65.91 27.94,52.32 29.59,50.67 29.59,41.91 30.23,41.28 36.45,41.28 v36.7,41.53
AN6  (via drill 0.6)
  Top 0.254: U1.26 38.41,46.03 37.87,46.56 v37.06,46.56 | v40.03,67.49 41.02,67.49 | 41.02,67.49 41.2,67.31 D8.1 41.31,66.18 C1.1 | R1.1 40.92,67.59 41.02,67.49
  Bottom 0.254: v37.06,46.56 33.73,46.56 32.33,47.96 32.33,51.77 31.06,53.04 31.06,60.3 31.24,60.48 31.29,60.48 31.93,61.11 38.79,61.11 39.68,62 39.68,67.13 v40.03,67.49
AN7  (via drill 0.6)
  Top 0.254: U1.25 37.61,42.66 v37.82,42.44 | v30.91,63.07 30.91,63.58 31.47,64.14 34.31,64.14 D9.1 C2.1 37.88,64.22 38.56,64.9 38.56,76.71 37.52,77.75 37.52,78.86 R23.1
  Bottom 0.254: v37.82,42.44 34.7,42.44 33.05,44.09 33.05,46.33 31.7,47.68 31.7,51.54 30.43,52.81 30.43,62.59 v30.91,63.07
GHT
  Top 1.27: D2.C 78.47,72.41 78.49,72.39 | 78.49,72.39 78.49,74.18 L1.2 | V1.2 78.41,70.43 78.49,70.36 | 78.49,70.36 78.49,72.39 | D1.A 78.31,70.18 78.49,70.36
GND  (via drill 0.5)  (1 unrouted)
  Top 0.254: U8.18 58.9,38 58.55,38.35
  Top 0.61: CASE2.12 16.81,90.73 CASE2.14
  Top 1.016: CASE2.28 CASE2.25 CASE2.22 CASE2.19 CASE2.16
  Bottom 0.61: CASE2.2 4.93,94.72 CASE2.4 8.89,98.65 CASE2.8 | CASE2.6 8.89,90.73 CASE2.8 | CASE2.8 12.85,94.72 CASE2.10 16.81,98.65 CASE2.14 23.8,94.69 24.51,93.98 24.51,86.11 24.77,85.85
  Bottom 1.016: CASE2.16 34.67,98.68 33.66,97.66 33.66,85.73 33.91,85.47
  other vias: 76.07,74.3 76.07,75.57 73.28,74.17 73.28,75.57 70.61,75.69 70.61,74.3 75.56,57.66 78.87,58.93 78.87,57.66 13.72,1.27 88.27,1.14 14.1,61.72 24.64,56.9 24.51,63.5 14.99,42.55 27.94,41.78 48.64,43.56 39.5,30.35 60.07,55.37 42.93,84.2 81.41,84.33 83.06,65.66 75.69,67.06 87.25,56.39 87.88,34.8 34.34,57.05 32.03,54.46 45.14,56.41 53.85,57.79 38.53,48.92 41.68,54.48 39.75,42.85 63.25,33.38 52.25,33.27 64.06,48.54 21.89,76.05 18.08,74.78 57.58,75.97 55.6,72.92 62.46,70.99
  pour Bottom (rank 6): 13.08,86.36 88.9,86.36 88.9,0.38 12.7,0.38
  pour Top (rank 6): 12.7,86.36 88.9,86.36 88.9,0.38 12.7,0.38
N$1
  Top 0.254: JP9.1 20.44,46.74 R40.1 | R40.1 20.57,43.85 C22.1 20.57,43.78 20.57,42.29 18.49,40.21 S2.3 | R40.1 23.23,46.6 23.24,46.61 | 23.24,46.61 23.24,45.22 R41.1 | 23.24,46.61 23.24,48.71 SJ1.2
N$2  (via drill 0.6)
  Top 0.254: U1.17 35.69,50.55 v36.14,50.09
  Bottom 0.254: v36.14,50.09 36.14,51.66 | 36.14,51.66 36.14,53.25 C21.1 | L3.1 36.37,51.44 36.14,51.66
N$3  (via drill 0.6)
  Top 0.305: CASE2.13 22.99,98.68 23.5,98.17 23.5,90.3 25.02,88.77 33.15,88.77 35.94,85.98 35.94,84.46 36.45,83.95 39.75,83.95 40.02,83.68 v40.13,83.57 40.51,83.19 40.54,83.19 40.92,82.8 R1.2
  Bottom 0.254: R6.1 40.95,82.75 v40.13,83.57
N$4  (via drill 0.6)
  Top 0.406: v38.79,59.94 39.17,59.59 39.22,59.54 U1.7
  Bottom 0.406: C8.A 38.46,59.11 38.79,59.44 v38.79,59.94
N$5
  Top 0.254: U1.1 44.01,57.34 44.32,57.66 48.64,57.66 50.67,59.69 51.93,59.69 R39.2
N$6
  Top 0.254: R43.1 85.41,59.62 LED1.A
N$7
  Top 0.254: CASE2.1 6.6,98.68 6.86,98.43 6.86,88.27 8,87.12 21.08,87.12 22.35,85.85 R19.1 22.37,81.66 23.6,81.66 24,81.26 R3.2
N$8
  Top 0.254: R41.2 26.04,45.21 26.42,45.59 26.42,49.28 27.18,50.04 29.49,50.04 29.77,49.76 34.19,49.76 U1.18 34.17,49.78
N$9  (via drill 0.6)
  Top 0.305: CASE2.15 21.82,90.7 24.77,87.76 32.13,87.76 34.67,85.22 34.67,83.44 34.92,83.19 v35.13,83.19 36.7,83.19 37.47,82.42 R23.2
  Bottom 0.254: R25.1 37.39,82.5 36.77,83.12 35.19,83.12 v35.13,83.19
N$10
  Top 0.254: SJ1.1 24.33,51.08 U9.1
N$11
  Top 0.406: CASE2.18 36.63,88.09 38.23,86.49 45.59,86.49 46.36,85.73 46.36,84.57 R2.2
N$12
  Top 0.254: JP9.4 14.99,54.36 14.48,54.86 14.48,59.82 15.49,60.83 36.32,60.83 38.35,58.8 38.35,56.4 U1.8
N$13
  Top 0.254: CASE2.3 4.93,88.8 7.49,86.23 18.29,86.23 19.94,84.58 19.94,81.77 R18.1 19.8,81.64 18.82,81.64 18.59,81.41 18.59,76.99 20.17,75.41 R4.2
N$14  (via drill 0.6)
  Top 0.254: v13.34,84.2 13.84,84.71 16.51,84.71 17.27,83.95 R17.1 17.24,81.61 15.65,81.61 15.22,81.18 15.22,76.61 16.31,75.51 R5.2
  Bottom 0.254: v13.34,84.2 10.16,84.2 6.98,87.38 6.98,92.79 CASE2.5
N$15
  Top 0.254: JP9.5 17.02,59.31 17.65,59.94 36.45,59.94 37.59,58.8 37.59,56.36 U1.9
N$16
  Top 0.406: CASE2.21 40.59,87.94 41.28,87.25 48.64,87.25 50.17,85.73 R7.2
N$17
  Top 0.406: CASE2.24 44.55,88.29 44.83,88.01 49.66,88.01 51.18,86.49 53.47,86.49 54.23,85.73 54.23,84.69 R8.2
N$18
  Top 0.406: CASE2.27 48.51,89.41 49.15,88.77 50.17,88.77 51.69,87.25 57.02,87.25 58.29,85.98 R9.2
N$19
  Top 0.254: R2.1 46.48,79.94 U6.1
N$20
  Top 0.254: U2.1 50.33,82.4 R7.1
N$21
  Top 0.254: R8.1 54.1,80.07 U3.1
N$22
  Top 0.254: U5.1 58.33,82.53 R9.1
N$23
  Top 0.254: R26.2 61.21,80.52 62.36,79.38 62.36,78.07 U11.4 62.48,77.94 62.48,76.84 62.36,76.71 60.96,76.71 60.52,76.27 U11.1
N$25
  Top 0.254: R24.1 LED3.A
N$26
  Top 0.254: CASE2.7 14.86,96.67 14.86,89.66 15.75,88.77 22.48,88.77 24.26,87 30.86,87 33.43,84.43 R20.1 35.04,81.65 35.36,81.33 35.36,76.12 35.71,75.77 36.99,75.77 R14.2
N$27
  Top 0.254: CASE2.9 12.85,88.88 13.72,88.01 21.97,88.01 23.75,86.23 29.59,86.23 30.86,84.96 30.86,81.7 R21.1 30.87,81.69 30.05,81.69 29.84,81.48 29.84,77.75 30.61,76.99 30.61,74.83 31.08,74.36 R15.2
N$28  (via drill 0.6)
  Top 0.254: v27.43,84.58 28.45,83.57 R22.1 28.34,81.53 26.95,81.53 26.57,81.15 26.57,76.96 28.32,75.21 R16.2
  Bottom 0.254: v27.43,84.58 21.72,84.58 18.8,87.5 18.8,92.71 CASE2.11
N$31
  Top 0.254: TX2.A 85.22,72.14 84.96,71.88 R27.1
N$32
  Top 0.254: RX2.A 87,72.26 87.25,72.01 87.25,71.1 R28.1
N$36
  Top 0.254: R38.1 57.55,53.07 57.91,52.71 57.91,51.05 U14.7
N$37
  Top 0.254: R39.1 LED7.A
N$39
  Top 0.254: U1.31 42.41,41.03 42.93,40.51 44.01,40.51 Y1.3 46.36,40.52 C24.1
N$40
  Top 0.254: C23.1 40.18,38.09 Y1.1 40.19,38.35 41.02,38.35 41.61,38.94 U1.30
N$78
  Top 0.254: U8.16 58.8,36.7 58.29,36.2 58.29,30.48 JP1.2
N$79
  Top 0.254: U8.15 59.65,34.33 60.2,33.78 60.2,29.85 JP1.1
N$81  (via drill 0.6)
  Top 0.254: v63.63,44.45 61.66,44.45 TX.A
  Bottom 0.254: R87.1 62.99,43.82 v63.63,44.45
N$82  (via drill 0.6)
  Top 0.254: v63.37,40.89 63.37,37.97 62.99,37.59 61.61,37.59 RX.A
  Bottom 0.254: R88.1 62.74,41.53 v63.37,40.89
N$83
  Top 0.254: TX.C 61.65,41.71 61.21,41.28 59.68,41.28 U8.23
N$84
  Top 0.254: U8.22 61.26,40.6 61.6,40.26 RX.C
N$85  (via drill 0.6)
  Top 0.254: U8.20 58.24,39.3 v57.53,39.37 | v50.8,42.55 U8.4
  Bottom 0.254: R88.2 R87.2 | v57.53,39.37 56.64,39.37 55.88,40.13 55.88,41.51 R88.2 | R88.2 51.31,41.53 50.8,42.04 v50.8,42.55
  Bottom 0.305: C34.1 55.27,33.3 54.74,32.77
  Bottom 0.406: JP1.3 54.99,32.51 54.74,32.77 53.21,34.29 53.21,35.7 C33.A 50.87,35.75 50.67,35.94 50.67,42.42 v50.8,42.55
N$86
  Top 0.254: TX1.A 65.35,70.65 R81.1
N$87
  Top 0.254: RX1.A 67.46,70.62 R82.1
N$93
  Top 0.254: U14.2 57.89,46.58 57.53,46.23 52.83,46.23 52.32,45.72 52.32,44.51 U8.1
N$94
  Top 0.254: U8.5 53.58,41.9 53.85,42.16 53.85,45.21 54.23,45.59 57.91,45.59 58.55,46.23 U14.3 | U14.3
OUT-B-P  (via drill 0.6)
  Top 0.254: v61.34,92.46 61.34,83.42 R26.1
  Bottom 0.254: CASE2.39 72.85,92.38 72.52,92.71 61.6,92.71 v61.34,92.46
RS485-1-A
  Top 0.406: U13.6 67.82,87.66 68.33,88.16 70.21,88.16 70.92,88.88 70.92,94.03 70.38,94.56 69.01,94.56 CASE2.35
RS485-1-B
  Top 0.406: U13.7 66.55,89.23 66.93,89.61 66.93,96.72 CASE2.34
RS485-2-A
  Top 0.406: U4.6 86.54,87.63 87.1,88.19 89.84,88.19 90.7,89.05 90.7,96.67 CASE2.40
RS485-2-B
  Top 0.406: U4.7 85.27,93.52 86.36,94.62 88.62,94.62 CASE2.41
RXD1  (via drill 0.6)
  Top 0.254: TX1.C 65.35,75.39 65.37,75.78 65.21,75.93 | U1.2 43.21,57.81 43.56,58.17 48.26,58.17 49.53,59.44 49.53,62.48 50.17,63.12 63.63,63.12 v64.14,62.61 | v64.16,76.35 64.8,76.35 65.21,75.93 | U13.1 65.28,76 65.21,75.93
  Bottom 0.254: v64.14,62.61 64.14,75.95 v64.16,76.35
RXD2  (via drill 0.5)
  Top 0.254: 85.19,76.73 v85.19,76.66 | v85.19,76.66 TX2.C | U1.43 47.14,53.75 47.5,54.1 47.5,55.12 47.88,55.5 57.68,55.5 v58.17,55.12 58.54,54.74 U14.6 | v60.71,57.53 61.47,57.53 62.61,58.67 62.61,60.58 62.99,60.96 65.79,60.96 66.29,61.47 68.33,61.47 v68.83,60.96 | v81.92,64.9 81.92,76.2 v81.61,76.66 | v85.19,76.66 85.19,76.71 | U4.1 84,77.09 84.43,76.66 v85.19,76.66
  Bottom 0.254: v58.17,55.12 58.17,56.64 58.93,57.4 60.58,57.4 v60.71,57.53 | v68.83,60.96 68.83,59.69 69.72,58.8 75.31,58.8 76.84,60.33 76.84,64.01 77.34,64.52 81.53,64.52 v81.92,64.9 | v85.19,76.66 v81.61,76.66
TXD1
  Top 0.254: U1.3 42.41,58.41 42.93,58.93 47.63,58.93 48.64,59.94 48.64,63.12 49.66,64.14 67.56,64.14 68.83,65.41 68.83,74.3 68.45,74.68 67.5,74.68 RX1.C 67.54,74.79 67.54,75.72 67.87,76.05 68.73,76.05 69.09,76.4 U13.4
TXD2  (via drill 0.5)
  Top 0.254: U1.44 45.81,55.71 46.23,56.13 59.18,56.13 | 59.18,56.13 U14.5 | 59.18,56.13 59.18,57.4 60.33,58.55 61.72,58.55 61.85,58.67 61.85,60.71 62.61,61.47 65.15,61.47 66.17,62.48 v68.45,62.48 | v88.52,75.95 87.6,75.95 RX2.C 87,76.58 87.3,76.89 87.33,76.89 87.78,77.34 87.78,79.05 U4.4
  Bottom 0.254: v68.45,62.48 69.24,62.51 69.88,61.87 69.88,59.94 70.26,59.56 74.93,59.56 76.2,60.83 76.2,64.77 76.84,65.41 80.77,65.41 81.79,66.42 81.79,71.37 82.42,71.88 87.76,71.88 88.14,72.26 88.14,75.69 88.39,75.95 v88.52,75.95
U4  (via drill 0.6)
  Top 0.254: 70.81,56.62 v70.81,60.6 70.81,56.62 | 70.81,56.62 v69.98,55.78 | v41.1,59.69 40.79,59.39 40.79,56.36 U1.5
  Top 0.406: U4.3 U4.2 85.27,80.7 v85.8,81.23
  Bottom 0.254: 84.86,79.45 80.8,79.45 80.29,78.94 80.29,66.73 79.83,66.27 76.78,66.27 75.49,64.97 75.49,60.91 74.73,60.15 71.27,60.15 v70.81,60.6 | v69.98,55.78 66.47,55.78 65.33,54.64 65.33,50.29 64.67,49.63 62.38,49.63 61.14,50.88 55.4,50.88 54.79,50.27 54.79,46.51 54.1,45.82 45.44,45.82 44.07,44.45 39.35,44.45 38.63,45.16 38.63,46.89 37.62,47.9 34.14,47.9 33.6,48.44 33.6,54.59 34.92,55.91 40.36,55.91 U1.5 40.81,59.4 v41.1,59.69
  Bottom 0.406: v85.8,81.23 85.8,80.39 84.86,79.45
U13  (via drill 0.6)
  Top 0.254: U13.3 U13.2 66.55,80.59 66.27,80.87 64.16,80.87 63.78,80.49 63.78,78.64 v63.68,78.54 | v63.14,65.08 49.63,65.08 47.93,63.37 47.93,60.12 47.4,59.59 42.77,59.59 41.61,58.42 U1.4 | U1.4
  Bottom 0.254: v63.68,78.54 63.12,78.54 62.76,78.18 62.76,74.85 63.45,74.17 63.45,65.38 v63.14,65.08
WDI
  Top 0.254: U1.10 36.81,58.57 36.2,59.18 21.84,59.18 21.21,58.55 21.21,53.5 U9.4
WS1  (via drill 0.5, 0.6)
  Top 0.254: U6.4 46.48,73.47 R13.1 48.12,71.1 v48.39,71.37 | v48.77,52.83 48.51,52.83 48.39,52.96 45.82,52.96 U1.42
  Bottom 0.254: v48.39,71.37 48.39,53.21 v48.77,52.83
WS2  (via drill 0.5)
  Top 0.254: U2.4 50.29,73.47 R12.1 52.05,71.1 v52.32,71.37 | v50.29,51.94 47.75,51.94 47.5,52.2 45.86,52.2 U1.41
  Bottom 0.254: v52.32,71.37 50.04,71.37 49.02,70.36 49.02,54.36 50.29,53.09 v50.29,51.94
WS3  (via drill 0.5)
  Top 0.254: U3.4 54.1,73.6 R11.1 55.99,71.1 v56.39,71.5 | v51.18,50.04 47.75,50.04 47.5,49.78 45.84,49.78 U1.38
  Bottom 0.254: v56.39,71.5 56.26,71.5 55.75,70.99 53.85,70.99 53.09,70.23 50.04,70.23 49.66,69.85 49.66,54.99 51.56,53.09 51.56,50.42 v51.18,50.04
WS4  (via drill 0.5)
  Top 0.254: U5.4 58.29,73.6 R10.1 59.8,71.1 v60.2,71.5 | v50.17,48.9 45.86,48.9 U1.37
  Bottom 0.254: v60.2,71.5 57.79,71.5 56.39,70.1 53.98,70.1 53.34,69.47 50.67,69.47 50.29,69.09 50.29,55.63 52.58,53.34 52.58,49.28 51.82,48.51 50.55,48.51 v50.17,48.9

### Text on the board
Top: RJ
tPlace: D2